# EasyEDA schematic SCH_TrailCheaper_2024-05-27.json

## Sheets
1 Sheet_1: TITLE: Sheet_1; REV: 1.0; Date: 2024-05-18; Sheet: 1/1; Drawn By: 100brightli; Company: Your Company
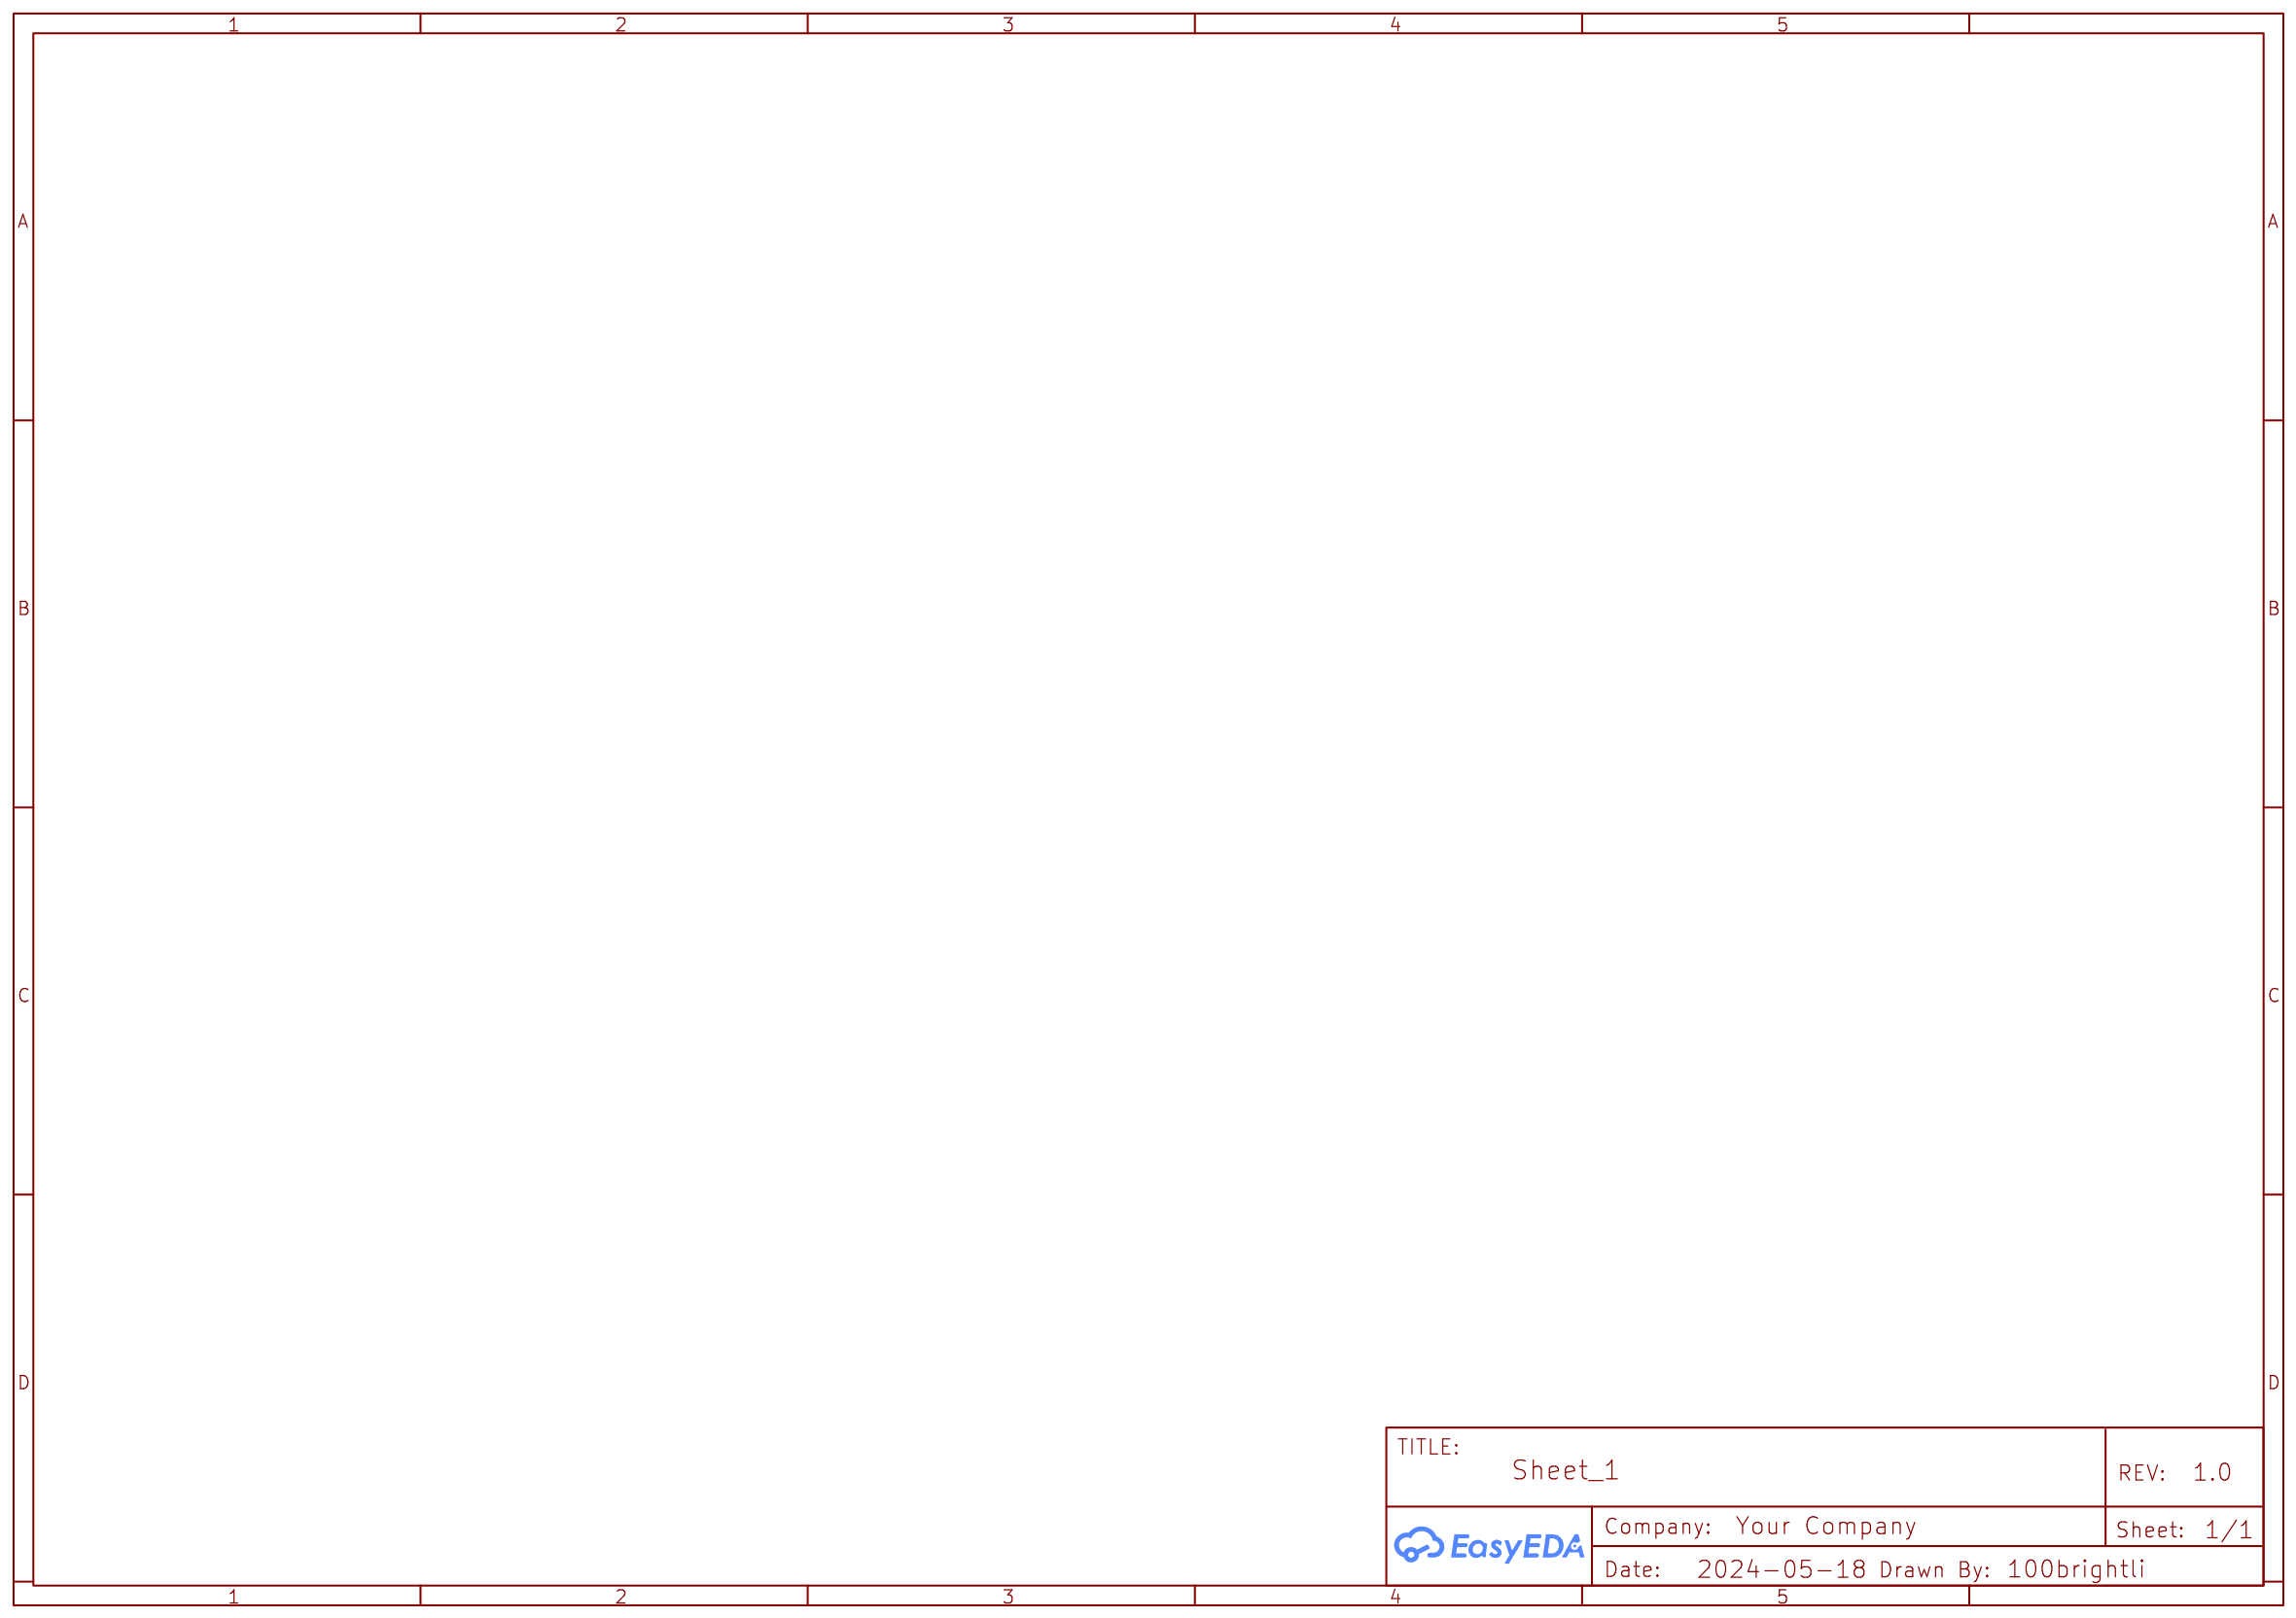
[diagram p0: Sheet_1]
2 Sheet_2_Cheaper? copy: TITLE: PCB Map; Date: 2024-05-03; Drawn By: Bright L., George W., Jackie L.; Company: The Trail
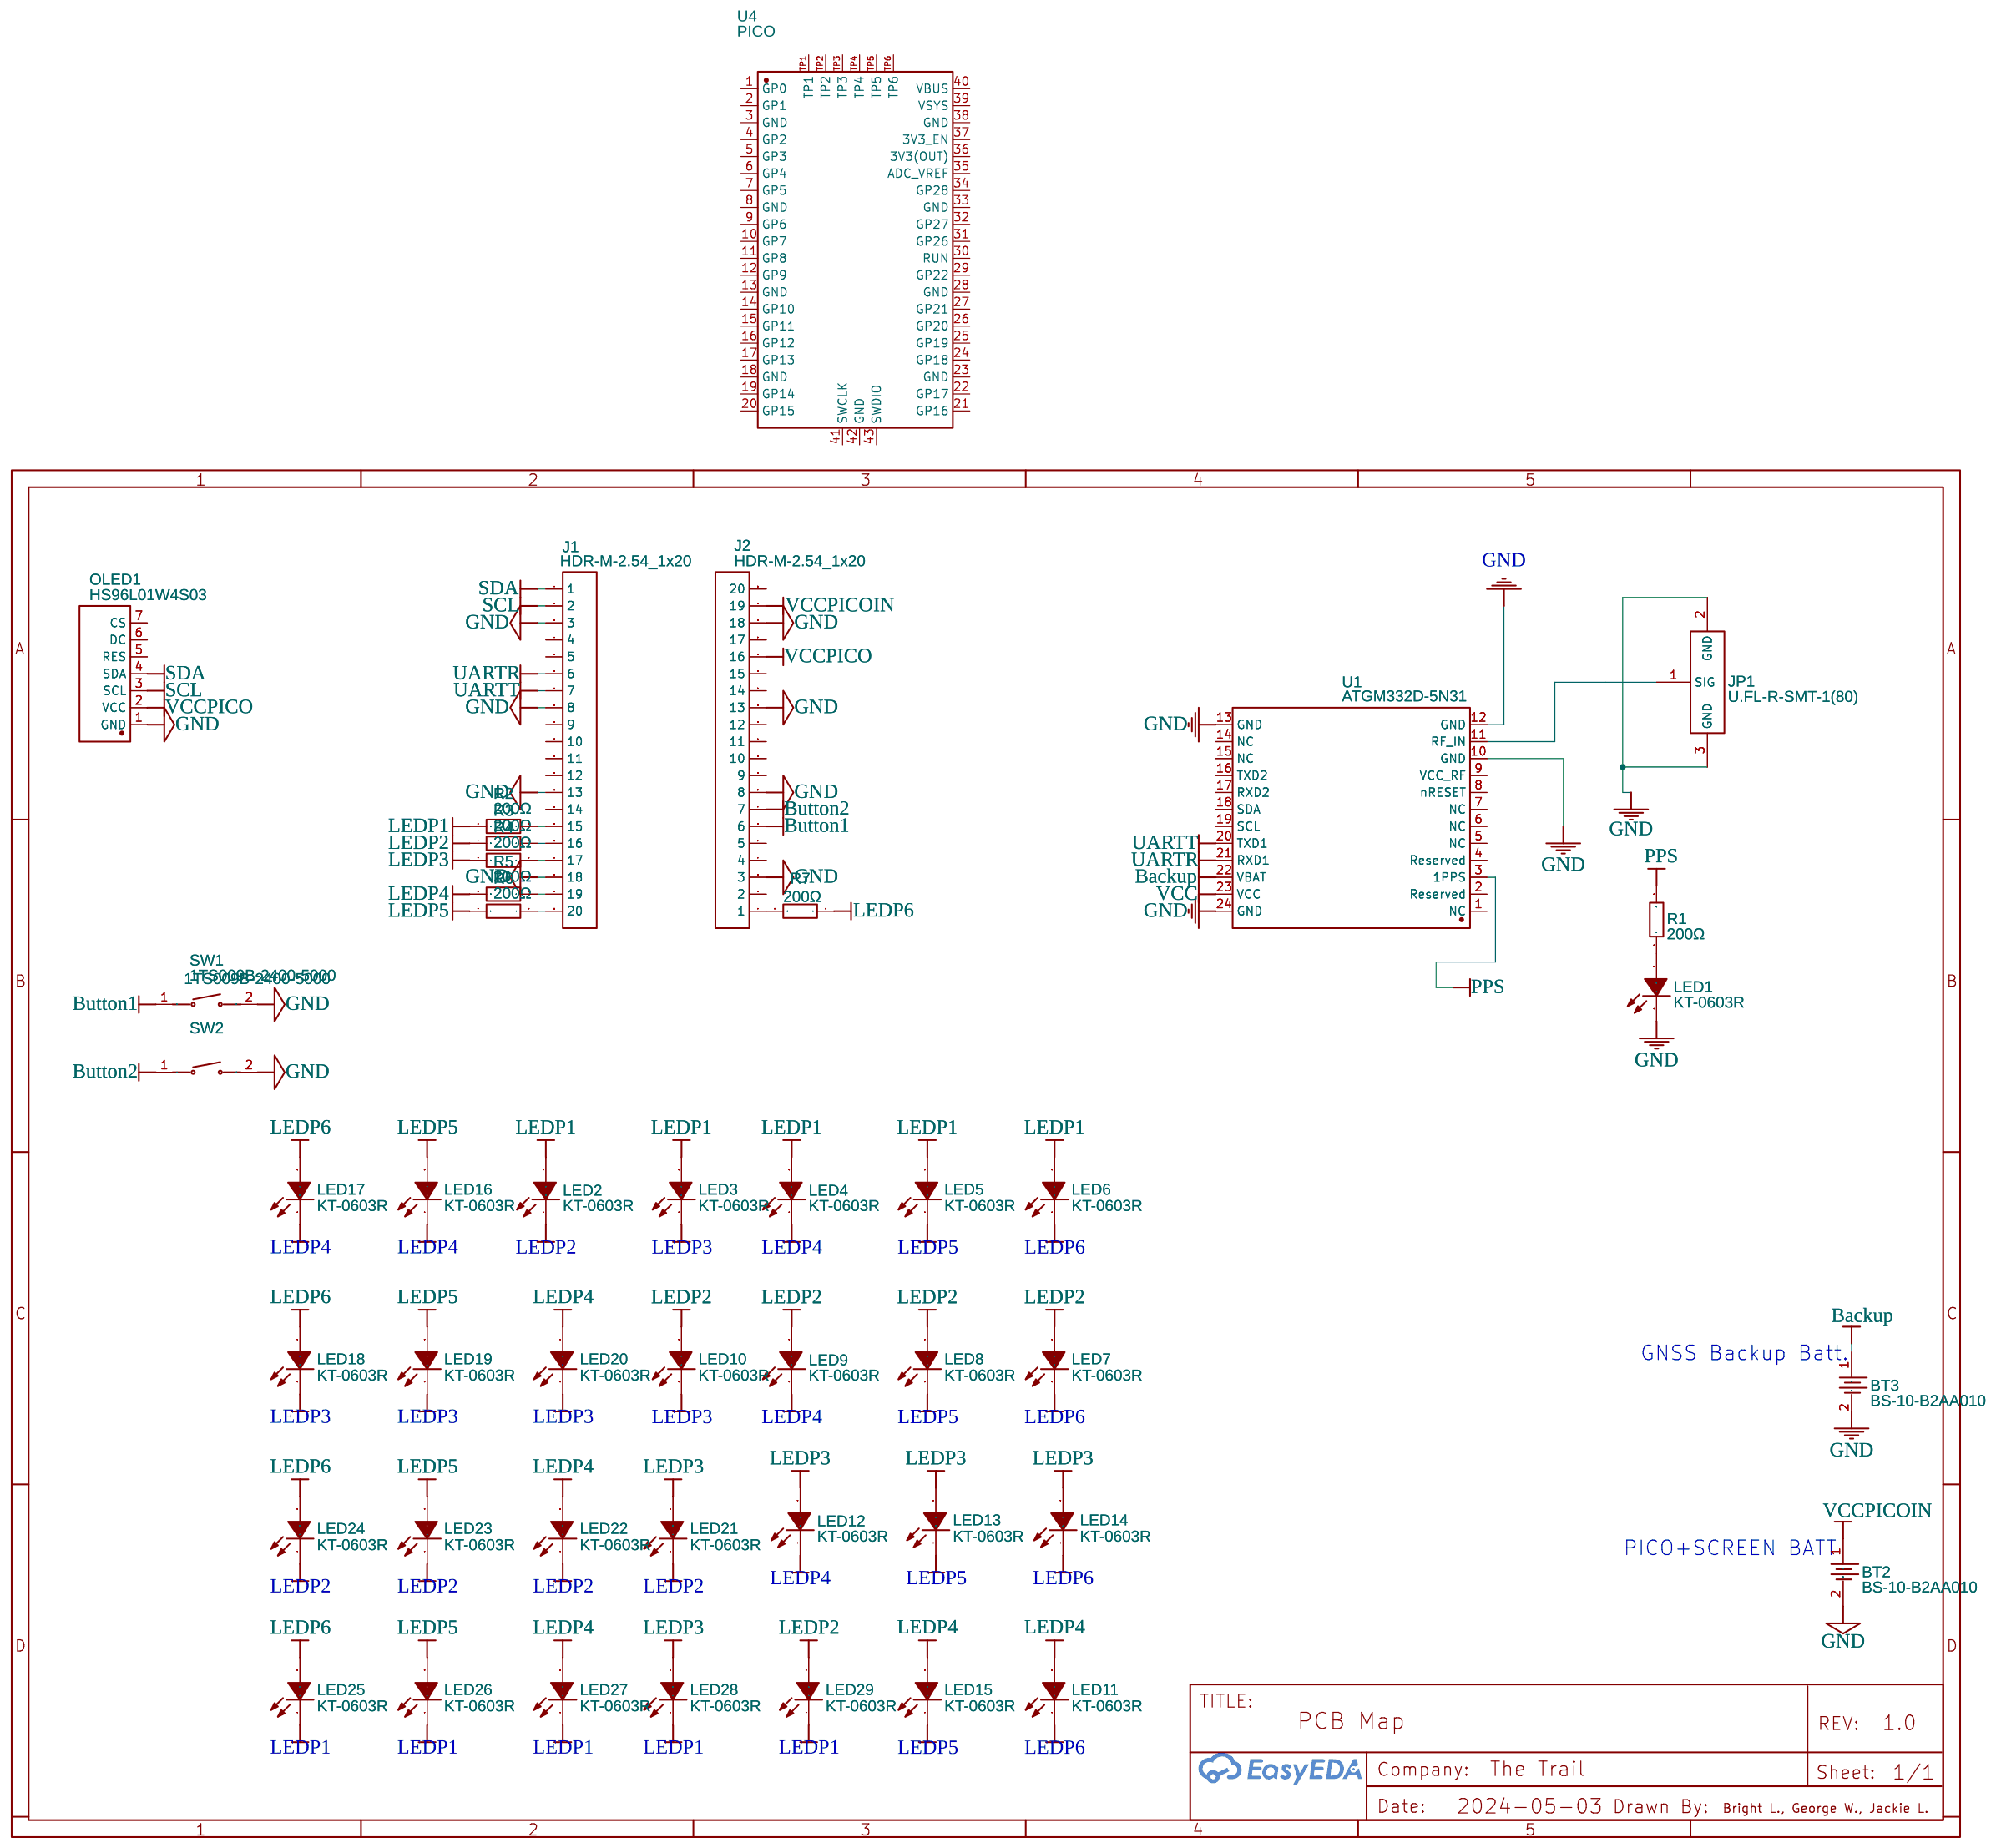
[diagram p1: Sheet_2_Cheaper? copy]

## Parts
BT2  BS-10-B2AA010  [BAT-SMD_BS-10-B2AA010]
BT3  BS-10-B2AA010  [BAT-SMD_BS-10-B2AA010]
J1  HDR-M-2.54_1x20  [HDR-M-2.54_1X20]
J2  HDR-M-2.54_1x20  [HDR-M-2.54_1X20]
JP1  U.FL-R-SMT-1(80)  [RF-SMD_FRF05002-JSS103M]
LED1  KT-0603R  [LED0603-RD]
LED2  KT-0603R  [LED0603-RD]
LED3  KT-0603R  [LED0603-RD]
LED4  KT-0603R  [LED0603-RD]
LED5  KT-0603R  [LED0603-RD]
LED6  KT-0603R  [LED0603-RD]
LED7  KT-0603R  [LED0603-RD]
LED8  KT-0603R  [LED0603-RD]
LED9  KT-0603R  [LED0603-RD]
LED10  KT-0603R  [LED0603-RD]
LED11  KT-0603R  [LED0603-RD]
LED12  KT-0603R  [LED0603-RD]
LED13  KT-0603R  [LED0603-RD]
LED14  KT-0603R  [LED0603-RD]
LED15  KT-0603R  [LED0603-RD]
LED16  KT-0603R  [LED0603-RD]
LED17  KT-0603R  [LED0603-RD]
LED18  KT-0603R  [LED0603-RD]
LED19  KT-0603R  [LED0603-RD]
LED20  KT-0603R  [LED0603-RD]
LED21  KT-0603R  [LED0603-RD]
LED22  KT-0603R  [LED0603-RD]
LED23  KT-0603R  [LED0603-RD]
LED24  KT-0603R  [LED0603-RD]
LED25  KT-0603R  [LED0603-RD]
LED26  KT-0603R  [LED0603-RD]
LED27  KT-0603R  [LED0603-RD]
LED28  KT-0603R  [LED0603-RD]
LED29  KT-0603R  [LED0603-RD]
OLED1  HS96L01W4S03  [OLED-TH_HS96L01W4S03]
R1  200Ω  [R0402]
R2  200Ω  [R0402]
R3  200Ω  [R0402]
R4  200Ω  [R0402]
R5  200Ω  [R0402]
R6  200Ω  [R0402]
R7  200Ω  [R0402]
SW1  1TS009B-2400-5000  [KEY-SMD_L6.0-W6.0-LS6.6]
SW2  1TS009B-2400-5000  [KEY-SMD_L6.0-W6.0-LS6.6]
U1  ATGM332D-5N31  [GSM-SMD_ATGM332D-5N31]
U4  PICO  [COMM-SMD_L51.0-W21.0-P2.54_SC0916]

## Library data of the parts
BT2 BT3 = BS-10-B2AA010: Contributor: LCSC; Supplier: LCSC; Supplier Part: C964798; Manufacturer: MYOUNG(美阳); JLCPCB Part Class: Extended Part
J1 J2 = HDR-M-2.54_1x20: Supplier Part: C50981; Supplier: LCSC; Contributor: LCEDA_Lib
JP1 = U.FL-R-SMT-1(80): Supplier: LCSC; Manufacturer: HRS(广濑); Supplier Part: C88374; JLCPCB Part Class: Extended Part
LED1-LED29 = KT-0603R: Supplier: LCSC; Manufacturer: KENTO; Supplier Part: C2286; JLCPCB Part Class: Basic Part
OLED1 = HS96L01W4S03: Supplier: LCSC; Supplier Part: C5139758; Manufacturer: HS(汉昇); JLCPCB Part Class: Extended Part; Contributor: lcsc
R1-R7 = 0402WGF2000TCE: Supplier: LCSC; Manufacturer: UNI-ROYAL(厚声); Supplier Part: C25087; JLCPCB Part Class: Basic Part
SW1 SW2 = 1TS009B-2400-5000: Contributor: LCSC; Supplier: LCSC; Supplier Part: C319422; Manufacturer: HYP(鸿源精密); Manufacturer Part: 1TS009B-2400-5000-CT; JLCPCB Part Class: Extended Part
U1 = ATGM332D-5N31: Contributor: LCSC; Supplier: LCSC; Manufacturer: 杭州中科微; Supplier Part: C128659; JLCPCB Part Class: Extended Part
U4 = PICO: Supplier: LCSC; Supplier Part: C7203002; Manufacturer: Raspberry Pi(树莓派); JLCPCB Part Class: Extended Part; Contributor: lcsc

## Nets
GND: BT2.2 BT3.2 J1.3 J1.8 J1.13 J1.18 J2.3 J2.8 J2.13 J2.18 JP1.2(GND) JP1.3(GND) LED1.1(K) OLED1.1(GND) SW1.2 SW2.2 U1.10(GND) U1.12(GND) U1.13(GND) U1.24(GND)
VCC: U1.23(VCC)
VCCPICO: J2.16 OLED1.2(VCC)
VCCPICOIN: BT2.1 J2.19
Backup: BT3.1 U1.22(VBAT)
Button1: J2.6 SW1.1
Button2: J2.7 SW2.1
LEDP1: LED2.2(A) LED3.2(A) LED4.2(A) LED5.2(A) LED6.2(A) LED25.1(K) LED26.1(K) LED27.1(K) LED28.1(K) LED29.1(K) R2.2
LEDP2: LED2.1(K) LED7.2(A) LED8.2(A) LED9.2(A) LED10.2(A) LED21.1(K) LED22.1(K) LED23.1(K) LED24.1(K) LED29.2(A) R3.2
LEDP3: LED3.1(K) LED10.1(K) LED12.2(A) LED13.2(A) LED14.2(A) LED18.1(K) LED19.1(K) LED20.1(K) LED21.2(A) LED28.2(A) R4.2
LEDP4: LED4.1(K) LED9.1(K) LED11.2(A) LED12.1(K) LED15.2(A) LED16.1(K) LED17.1(K) LED20.2(A) LED22.2(A) LED27.2(A) R5.2
LEDP5: LED5.1(K) LED8.1(K) LED13.1(K) LED15.1(K) LED16.2(A) LED19.2(A) LED23.2(A) LED26.2(A) R6.2
LEDP6: LED6.1(K) LED7.1(K) LED11.1(K) LED14.1(K) LED17.2(A) LED18.2(A) LED24.2(A) LED25.2(A) R7.1
PPS: R1.2 U1.3(1PPS)
SCL: J1.2 OLED1.3(SCL)
SDA: J1.1 OLED1.4(SDA)
UARTR: J1.6 U1.21(RXD1)
UARTT: J1.7 U1.20(TXD1)
Net-(J1-15): J1.15 R2.1
Net-(J1-16): J1.16 R3.1
Net-(J1-17): J1.17 R4.1
Net-(J1-19): J1.19 R5.1
Net-(J1-20): J1.20 R6.1
Net-(J2-1): J2.1 R7.2
Net-(JP1-1): JP1.1(SIG) U1.11(RF_IN)
Net-(LED1-2): LED1.2(A) R1.1

Not connected (* = marked no-connect by the designer): J1 4 5 9 10 11 12 14; J2 2 4 5 9 10 11 12 14 15 17 20; OLED1 5(RES) 6(DC) 7(CS); U1 1(NC) 2(Reserved) 4(Reserved) 5(NC) 6(NC) 7(NC) 8(nRESET) 9(VCC_RF) 14(NC) 15(NC) 16(TXD2) 17(RXD2) 18(SDA) 19(SCL); U4 1(GP0) 2(GP1) 3(GND) 4(GP2) 5(GP3) 6(GP4) 7(GP5) 8(GND) 9(GP6) 10(GP7) 11(GP8) 12(GP9) 13(GND) 14(GP10) 15(GP11) 16(GP12) 17(GP13) 18(GND) 19(GP14) 20(GP15) 21(GP16) 22(GP17) 23(GND) 24(GP18) 25(GP19) 26(GP20) 27(GP21) 28(GND) 29(GP22) 30(RUN) 31(GP26) 32(GP27) 33(GND) 34(GP28) 35(ADC_VREF) 36(3V3(OUT)) 37(3V3_EN) 38(GND) 39(VSYS) 40(VBUS) 41(SWCLK) 42(GND) 43(SWDIO) TP1 TP2 TP3 TP4 TP5 TP6

## Notes on the sheets
sheet 2
- GNSS Backup Batt.
- PICO+SCREEN BATT
